# Altium project D8B-三锂电65W充电节-带屏幕.PrjPcb
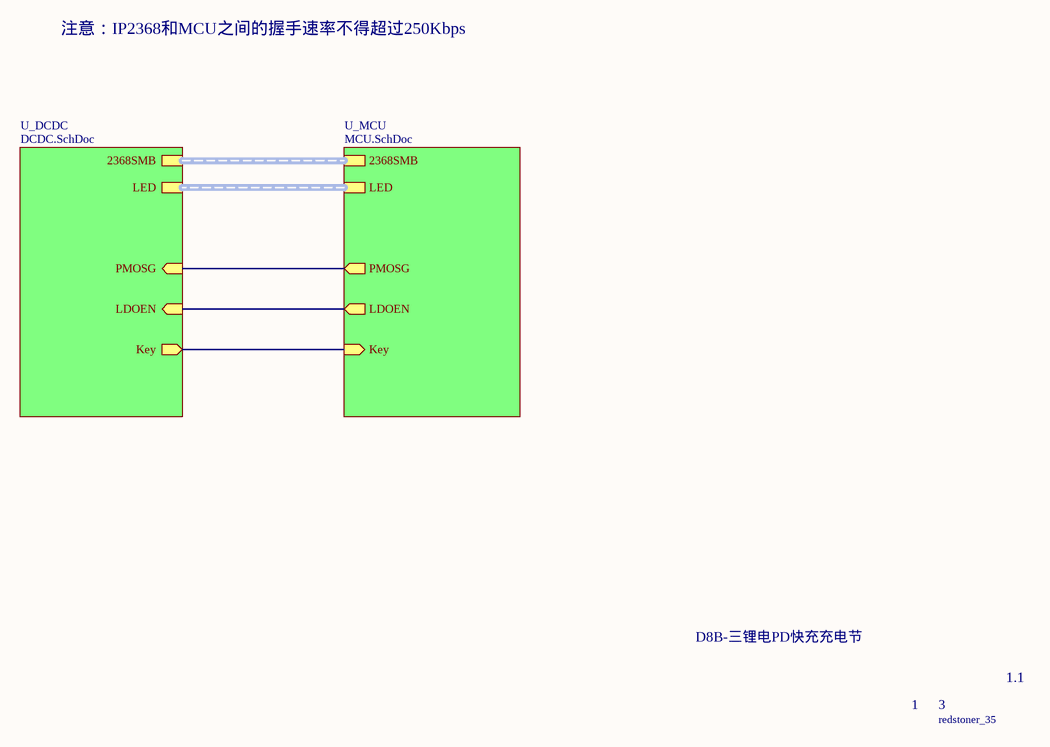
[diagram p0: Top.SchDoc]
3 sheets, 81 parts. Net scope: hierarchical (ports join the sheet entries above them; power ports are global).
Board file: PCB1.PcbDoc
Sheets:
  Top.SchDoc
    U_DCDC = DCDC.SchDoc
    U_MCU = MCU.SchDoc

## Sheet Top.SchDoc
size A4

### Sub-sheets
U_DCDC = DCDC.SchDoc: 2368SMB (harness 2368_SMB), PMOSG (in), LDOEN (in), LED (harness LED), Key (out)
U_MCU = MCU.SchDoc: PMOSG (out), 2368SMB (harness 2368_SMB), LDOEN (out), LED (harness LED), Key (in)

### Nets
Key: sheet U_DCDC/Key, sheet U_MCU/Key
MEN: sheet U_DCDC/LDOEN, sheet U_MCU/LDOEN
PMOSG: sheet U_DCDC/PMOSG, sheet U_MCU/PMOSG

### Buses and harness runs
harness sheet U_DCDC/2368SMB = sheet U_MCU/2368SMB
harness sheet U_DCDC/LED = sheet U_MCU/LED

### Notes on the sheet
- 注意：IP2368和MCU之间的握手速率不得超过250Kbps
- D8B-三锂电PD快充充电节
- 1
- 3
- 1.1
- redstoner_35

## Sheet DCDC.SchDoc
size A4
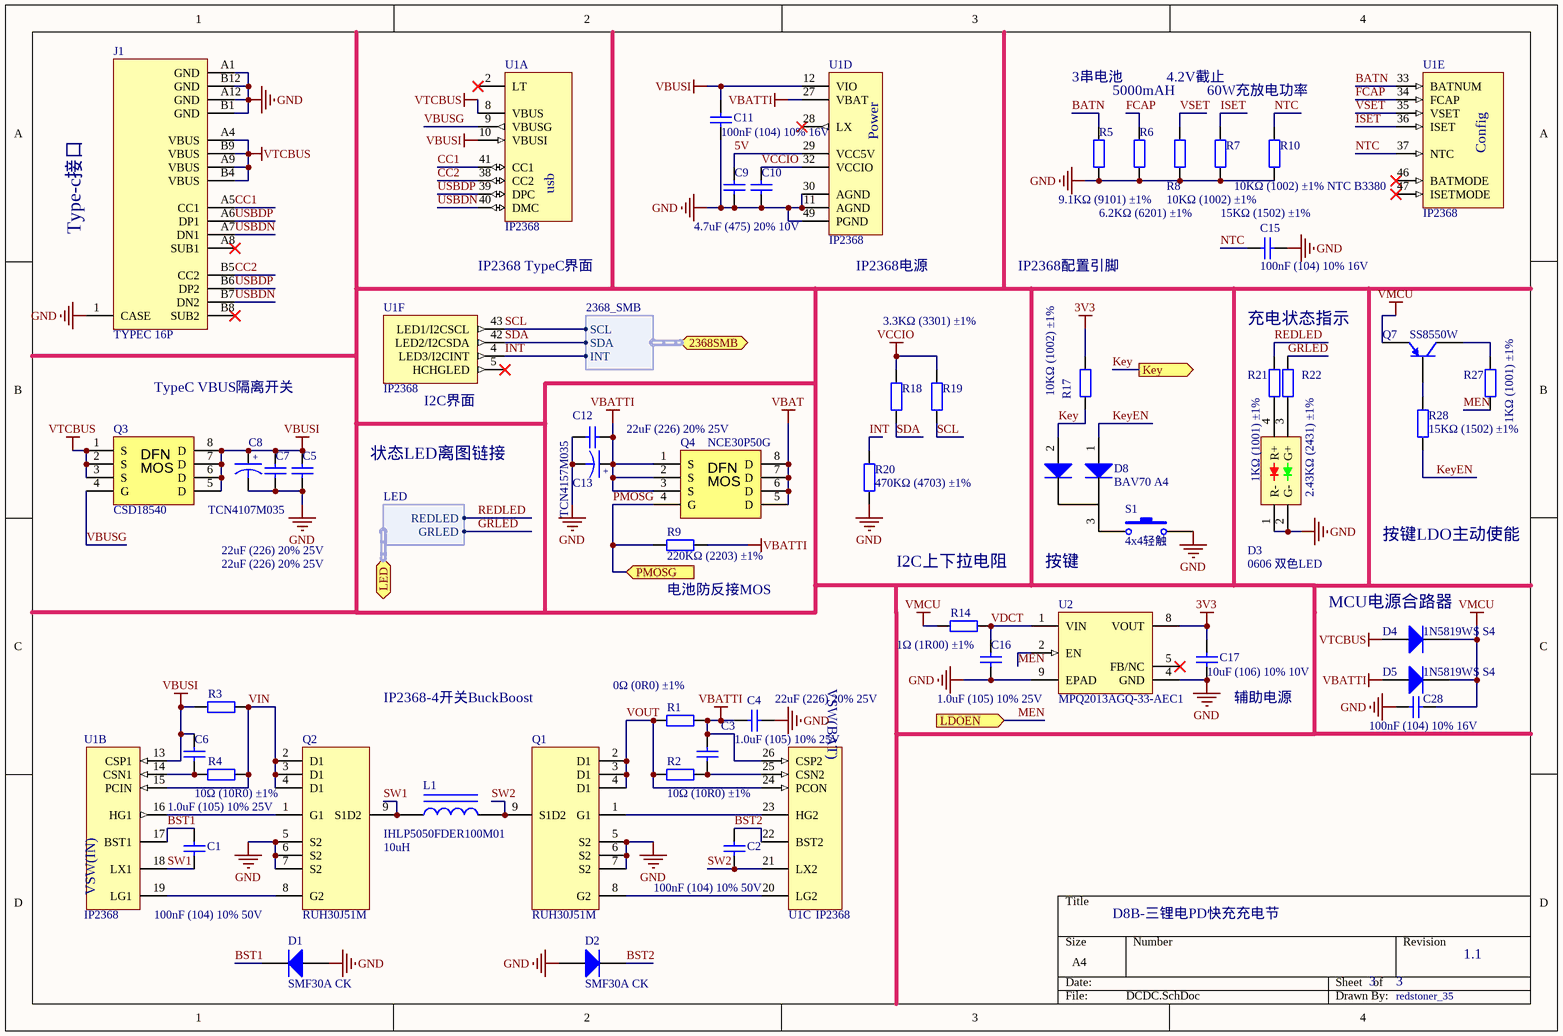
[diagram p1: DCDC.SchDoc]

### Parts
C1  100nF (104) 10% 50V  [0603_C]
C2  100nF (104) 10% 50V  [0603_C]
C3  1.0uF (105) 10% 25V  [0402_C]
C4  22uF (226) 20% 25V  [0805_C]
C5  22uF (226) 20% 25V  [0805_C]
C6  1.0uF (105) 10% 25V  [0402_C]
C7  22uF (226) 20% 25V  [0805_C]
C8  TCN4107M035  [TCN4]
C9  4.7uF (475) 20% 10V  [0402_C]
C10  4.7uF (475) 20% 10V  [0402_C]  (value not drawn)
C11  100nF (104) 10% 16V  [0402_C]
C12  22uF (226) 20% 25V  [0805_C]
C13  TCN4157M035  [TCN4]
C15  100nF (104) 10% 16V  [0402_C]
C16  1.0uF (105) 10% 25V  [0402_C]
C17  10uF (106) 10% 10V  [0603_C]
C28  100nF (104) 10% 16V  [0402_C]
D1  SMF30A CK  [SOD-123]
D2  SMF30A CK  [SOD-123]
D3  0606 双色LED  [LED-SMD_4P-L1.6-W1.5-TL-1]
D4  1N5819WS S4  [SOD-323]
D5  1N5819WS S4  [SOD-323]
D8  BAV70 A4  [SC70-3]
J1  TYPEC 16P  [USB-C-SMD_KH-TYPE-C-16P]
L1  IHLP5050FDER100M01  value 10uH  [IHLP5050FDER***M01]
Q1  RUH30J51M  [PDFN-8_L5.8-W4.9_RU30J30M]
Q2  RUH30J51M  [PDFN-8_L5.8-W4.9_RU30J30M]
Q3  CSD18540  [SON/DFN5x6(MOS)]
Q4  NCE30P50G  [SON/DFN5x6(MOS)]
Q7  SS8550W  [SC70-3]
R1  0Ω (0R0) ±1%  [1206_R]
R2  10Ω (10R0) ±1%  [0402_R]
R3  0Ω (0R0) ±1%  [1206_R]  (value not drawn)
R4  10Ω (10R0) ±1%  [0402_R]
R5  9.1KΩ (9101) ±1%  [0402_R]
R6  6.2KΩ (6201) ±1%  [0402_R]
R7  15KΩ (1502) ±1%  [0402_R]
R8  10KΩ (1002) ±1%  [0402_R]
R9  220KΩ (2203) ±1%  [0402_R]
R10  10KΩ (1002) ±1% NTC B3380  [0402_R]
R14  1Ω (1R00) ±1%  [0402_R]
R17  10KΩ (1002) ±1%  [0402_R]
R18  3.3KΩ (3301) ±1%  [0402_R]  (value not drawn)
R19  3.3KΩ (3301) ±1%  [0402_R]
R20  470KΩ (4703) ±1%  [0402_R]
R21  1KΩ (1001) ±1%  [0402_R]
R22  2.43KΩ (2431) ±1%  [0402_R]
R27  1KΩ (1001) ±1%  [0402_R]
R28  15KΩ (1502) ±1%  [0402_R]
S1  4x4轻触  [SW-SMD_4P-L5.2-W5.2-P3.70-LS6.4]
U1  IP2368  [QFN50P700X700X100_HS-49M]  (parts A,B,C,D,E,F of 6)
U2  MPQ2013AGQ-33-AEC1  [MPQ2013A-QFN8]

### Ports
2368SMB (harness 2368_SMB), Key (out), LDOEN (in), LED (harness LED), PMOSG (in)

### Harnesses
2368_SMB: SCL, SDA, INT
LED: REDLED, GRLED

### Nets
3V3: C17.2 R17.2 U2.8(VOUT)
GND: C4.2 C5.1 C7.1 C8.2 C9.1 C10.1 C11.1 C12.2 C13.2 C15.2 C16.1 C17.1 C28.1 D1.1(A) D2.1(A) D3.1(R-) D3.2(G-) J1.1(CASE) J1.A1(GND) J1.A12(GND) J1.B1(GND) J1.B12(GND) Q1.5(S2) Q1.6(S2) Q1.7(S2) Q2.5(S2) Q2.6(S2) Q2.7(S2) R5.1 R6.1 R7.1 R8.1 R10.1 R20.1 S1.2 U1.11(AGND) U1.30(AGND) U1.49(PGND) U2.4(GND) U2.9(EPAD)
VBAT: Q4.5(D) Q4.6(D) Q4.7(D) Q4.8(D)
VBATTI: C3.2 C4.1 C12.1 C13.1 D5.1(A) Q4.1(S) Q4.2(S) Q4.3(S) R1.2 R9.2 U1.26(CSP2) U1.27(VBAT)
VBUSI: C5.2 C6.2 C7.2 C8.1 C11.2 Q3.5(D) Q3.6(D) Q3.7(D) Q3.8(D) R3.1 U1.10(VBUSI) U1.12(VIO) U1.13(CSP1)
VCCIO: C10.2 R18.2 R19.2 U1.32(VCCIO)
VMCU: C28.2 D4.2(K) D5.2(K) Q7.2(E) R14.1
VTCBUS: D4.1(A) J1.A4(VBUS) J1.A9(VBUS) J1.B4(VBUS) J1.B9(VBUS) Q3.1(S) Q3.2(S) Q3.3(S) U1.8(VBUS)
5V: C9.2 U1.29(VCC5V)
BATN: R5.2 U1.33(BATNUM)
BST1: C1.2 D1.2(K) U1.17(BST1)
BST2: C2.2 D2.2(K) U1.22(BST2)
CC1: J1.A5(CC1) U1.41(CC1)
CC2: J1.B5(CC2) U1.38(CC2)
FCAP: R6.2 U1.34(FCAP)
GRLED: R22.1 ; port LED.GRLED
INT: R20.2 U1.4(LED3/I2CINT) ; port 2368SMB.INT
ISET: R7.2 U1.36(ISET)
Key: D8.2(A) R17.1 ; port Key
KeyEN: D8.1(A) R28.1
MEN: R27.1 U2.2(EN) ; port LDOEN
NTC: C15.1 R10.2 U1.37(NTC)
PMOSG: Q4.4(G) R9.1 ; port PMOSG
REDLED: R21.2 ; port LED.REDLED
SCL: R19.1 U1.43(LED1/I2CSCL) ; port 2368SMB.SCL
SDA: R18.1 U1.42(LED2/I2CSDA) ; port 2368SMB.SDA
SW1: C1.1 L1.1 Q2.9(S1D2) U1.18(LX1)
SW2: C2.1 L1.2 Q1.9(S1D2) U1.21(LX2)
USBDN: J1.A7(DN1) J1.B7(DN2) U1.40(DMC)
USBDP: J1.A6(DP1) J1.B6(DP2) U1.39(DPC)
VBUSG: Q3.4(G) U1.9(VBUSG)
VDCT: C16.2 R14.2 U2.1(VIN)
VIN: Q2.2(D1) Q2.3(D1) Q2.4(D1) R3.2 R4.2 U1.15(PCIN)
VOUT: Q1.2(D1) Q1.3(D1) Q1.4(D1) R1.1 R2.1 U1.24(PCON)
VSET: R8.2 U1.35(VSET)
NetC3_1: C3.1 R2.2 U1.25(CSN2)
NetC6_1: C6.1 R4.1 U1.14(CSN1)
NetD3_3: D3.3(G+) R22.2
NetD3_4: D3.4(R+) R21.1
NetD8_3: D8.3(K) S1.1
NetQ1_1: Q1.1(G1) U1.23(HG2)
NetQ1_8: Q1.8(G2) U1.20(LG2)
NetQ2_1: Q2.1(G1) U1.16(HG1)
NetQ2_8: Q2.8(G2) U1.19(LG1)
NetQ7_1: Q7.1(B) R28.2
NetQ7_3: Q7.3(C) R27.2

Not connected (* = marked no-connect by the designer): J1 A8(SUB1)* B8(SUB2)*; U1 2(LT)* 5(HCHGLED)* 28(LX)* 46(BATMODE)* 47(ISETMODE)*; U2 5(FB/NC)*

### Notes on the sheet
- 3串电池
- 5000mAH
- 4.2V截止
- 60W充放电功率
- (near J1) Type-c接口
- (near U1) IP2368 TypeC界面
- (near U1) IP2368电源
- IP2368配置引脚
- 充电状态指示
- TypeC VBUS隔离开关
- (near U1) I2C界面
- 状态LED离图链接
- I2C上下拉电阻
- 按键
- 按键LDO主动使能
- (near R9) 电池防反接MOS
- (near D4) MCU电源合路器
- IP2368-4开关BuckBoost
- (near C17) 辅助电源
- D8B-三锂电PD快充充电节
- 3
- 1.1
- redstoner_35
- (in symbol CAP2) +
- (in symbol IP2368, part A) usb
- (in symbol IP2368, part B) VSW(IN)
- (in symbol IP2368, part C) VSW(BAT)
- (in symbol IP2368, part D) Power
- (in symbol IP2368, part E) Config
- (in symbol SON/DFN5x6 MOS) DFN; MOS

### Library data of the parts
C1 C2 = 0603 100nF (104) 10% 50V: 贴片电容; ComponentLink1Description: 供应商链接; ComponentLink1URL: http://www.szlcsc.com/product/details_15331.html; Package: 0603; Supplier: LC; SuppliersPartNumber: C14663
C3 C6 C16 = 0402 1.0uF (105) 10% 25V: 贴片电容; ComponentLink1Description: 供应商链接; ComponentLink1URL: http://www.szlcsc.com/product/details_53938.html; Package: 0402; Supplier: LC; SuppliersPartNumber: C52923
C4 C5 C7 C12 = 0805 22uF (226) 20% 25V: 贴片电容; ComponentLink1Description: 供应商链接; ComponentLink1URL: http://www.szlcsc.com/product/details_46786.html; Package: 0805; Supplier: LC; SuppliersPartNumber: C45783
C8 C13 = CAP2: Capacitor
C9 C10 = 0402 4.7uF (475) 20% 10V: 贴片电容; ComponentLink1Description: 供应商链接; ComponentLink1URL: http://www.szlcsc.com/product/details_24469.html; Package: 0402; Supplier: LC; SuppliersPartNumber: C23733
C11 C15 C28 = 0402 100nF (104) 10% 16V: 贴片电容; ComponentLink1Description: 供应商链接; ComponentLink1URL: http://www.szlcsc.com/product/details_1877.html; Package: 0402; Supplier: LC; SuppliersPartNumber: C1525
C17 = 0603 10uF (106) 10% 10V: 贴片电容; ComponentLink1Description: 供应商链接; ComponentLink1URL: http://www.szlcsc.com/product/details_20411.html; Package: 0603; Supplier: LC; SuppliersPartNumber: C19702
D1 D2 = SOD-123 B5819W  SL: TVS二极管; ComponentLink1Description: 供应商链接; ComponentLink1URL: http://www.szlcsc.com/product/details_9093.html; Package: SOD-123; Supplier: LC; SuppliersPartNumber: C??????
D3 = 0606DualColor LED: 0606 双色LED 红色/翠绿
D4 D5 = SOD-323 1N4148WS T4: 二极管; ComponentLink1Description: 供应商链接; ComponentLink1URL: http://www.szlcsc.com/product/details_2485.html; Package: SOD-323; Supplier: LC; SuppliersPartNumber: C??????
D8 = SOT-23 BAV70 A4: 开关二极管; ComponentLink1Description: 供应商链接; ComponentLink1URL: http://www.szlcsc.com/product/details_70091.html; Package: SOT-23; Supplier: LC; SuppliersPartNumber: C68978
J1 = KH-TYPEC-16P: 16Pin TypeC立贴座子
L1 = Inductor Iron: Vishay Inductor 10uH 16.4mR 15.5A; Published: 24-Mar-1999; LatestRevisionDate: 17-Jul-2002; LatestRevisionNote: Re-released for DXP Platform.; PackageReference: AXIAL-0.9; Publisher: Altium Limited; PackageDescription: Axial Device, Thru-Hole; 2 Leads; 0.9 in Pin Spacing
Q1 Q2 = RU30J30M: Dual N MOSFET 30V/51A
Q3 Q4 = SON/DFN5x6 MOS: Gerenal DFN/SON Package MOSFET
Q7 = SOT-23 SS8550 Y2: 三极管; ComponentLink1Description: 供应商链接; ComponentLink1URL: http://www.szlcsc.com/product/details_9037.html; Package: SOT-23; Supplier: LC; SuppliersPartNumber: C8542
R1 R3 = 1206 0Ω (0R0) 1%: 贴片电阻; ComponentLink1Description: 供应商链接; ComponentLink1URL: http://www.szlcsc.com/product/details_18576.html; Package: 1206; Supplier: LC; SuppliersPartNumber: C17888
R2 R4 = 0402 10Ω (10R0) 1%: 贴片电阻; ComponentLink1Description: 供应商链接; ComponentLink1URL: http://www.szlcsc.com/product/details_25820.html; Package: 0402; Supplier: LC; SuppliersPartNumber: C25077
R5 R6 = 0402 0Ω (0R0) 1%: 贴片电阻; ComponentLink1Description: 供应商链接; ComponentLink1URL: http://www.szlcsc.com/product/details_17853.html; Package: 0402; Supplier: LC; SuppliersPartNumber: C17168
R7 R28 = 0402 15KΩ (1502) 1%: 贴片电阻; ComponentLink1Description: 供应商链接; ComponentLink1URL: http://www.szlcsc.com/product/details_26499.html; Package: 0402; Supplier: LC; SuppliersPartNumber: C25756
R8 R17 = 0402 10KΩ (1002) 1%: 贴片电阻; ComponentLink1Description: 供应商链接; ComponentLink1URL: http://www.szlcsc.com/product/details_26487.html; Package: 0402; Supplier: LC; SuppliersPartNumber: C25744
R9 = 0402 220KΩ (2203) 1%: 贴片电阻; ComponentLink1Description: 供应商链接; ComponentLink1URL: http://www.szlcsc.com/product/details_26510.html; Package: 0402; Supplier: LC; SuppliersPartNumber: C25767
R10 = 0402 10KΩ (1002) 1%: 贴片NTC热敏电阻; ComponentLink1Description: 供应商链接; ComponentLink1URL: http://www.szlcsc.com/product/details_26487.html; Package: 0402; Supplier: LC; SuppliersPartNumber: C???????????
R14 = 0402 1Ω (1R00) 1%: 贴片电阻; ComponentLink1Description: 供应商链接; ComponentLink1URL: http://www.szlcsc.com/product/details_25829.html; Package: 0402; Supplier: LC; SuppliersPartNumber: C25086
R18 R19 = 0402 3.3KΩ (3301) 1%: 贴片电阻; ComponentLink1Description: 供应商链接; ComponentLink1URL: http://www.szlcsc.com/product/details_26633.html; Package: 0402; Supplier: LC; SuppliersPartNumber: C25890
R20 = 0402 470KΩ (4703) 1%: 贴片电阻; ComponentLink1Description: 供应商链接; ComponentLink1URL: http://www.szlcsc.com/product/details_26533.html; Package: 0402; Supplier: LC; SuppliersPartNumber: C25790
R21 R27 = 0402 1KΩ (1001) 1%: 贴片电阻; ComponentLink1Description: 供应商链接; ComponentLink1URL: http://www.szlcsc.com/product/details_12256.html; Package: 0402; Supplier: LC; SuppliersPartNumber: C11702
R22 = 0402 2KΩ (2001) 1%: 贴片电阻; ComponentLink1Description: 供应商链接; ComponentLink1URL: http://www.szlcsc.com/product/details_4516.html; Package: 0402; Supplier: LC; SuppliersPartNumber: C????????
S1 = SW-PB: Switch; pin to pad: 2>3; Published: 24-Mar-1999; LatestRevisionDate: 17-Jul-2002; LatestRevisionNote: Re-released for DXP Platform.; PackageReference: SPST-2; Publisher: Altium Limited; PackageDescription: Switch; 2 Leads
U1 = IP2368: IP2368 2-5S 双向电池充放电管理，100W PD
U2 = MPQ2013AGQ-xx-AEC1: MPS 40V LDO with Enable pin QFN3x3 package

## Sheet MCU.SchDoc
size A4
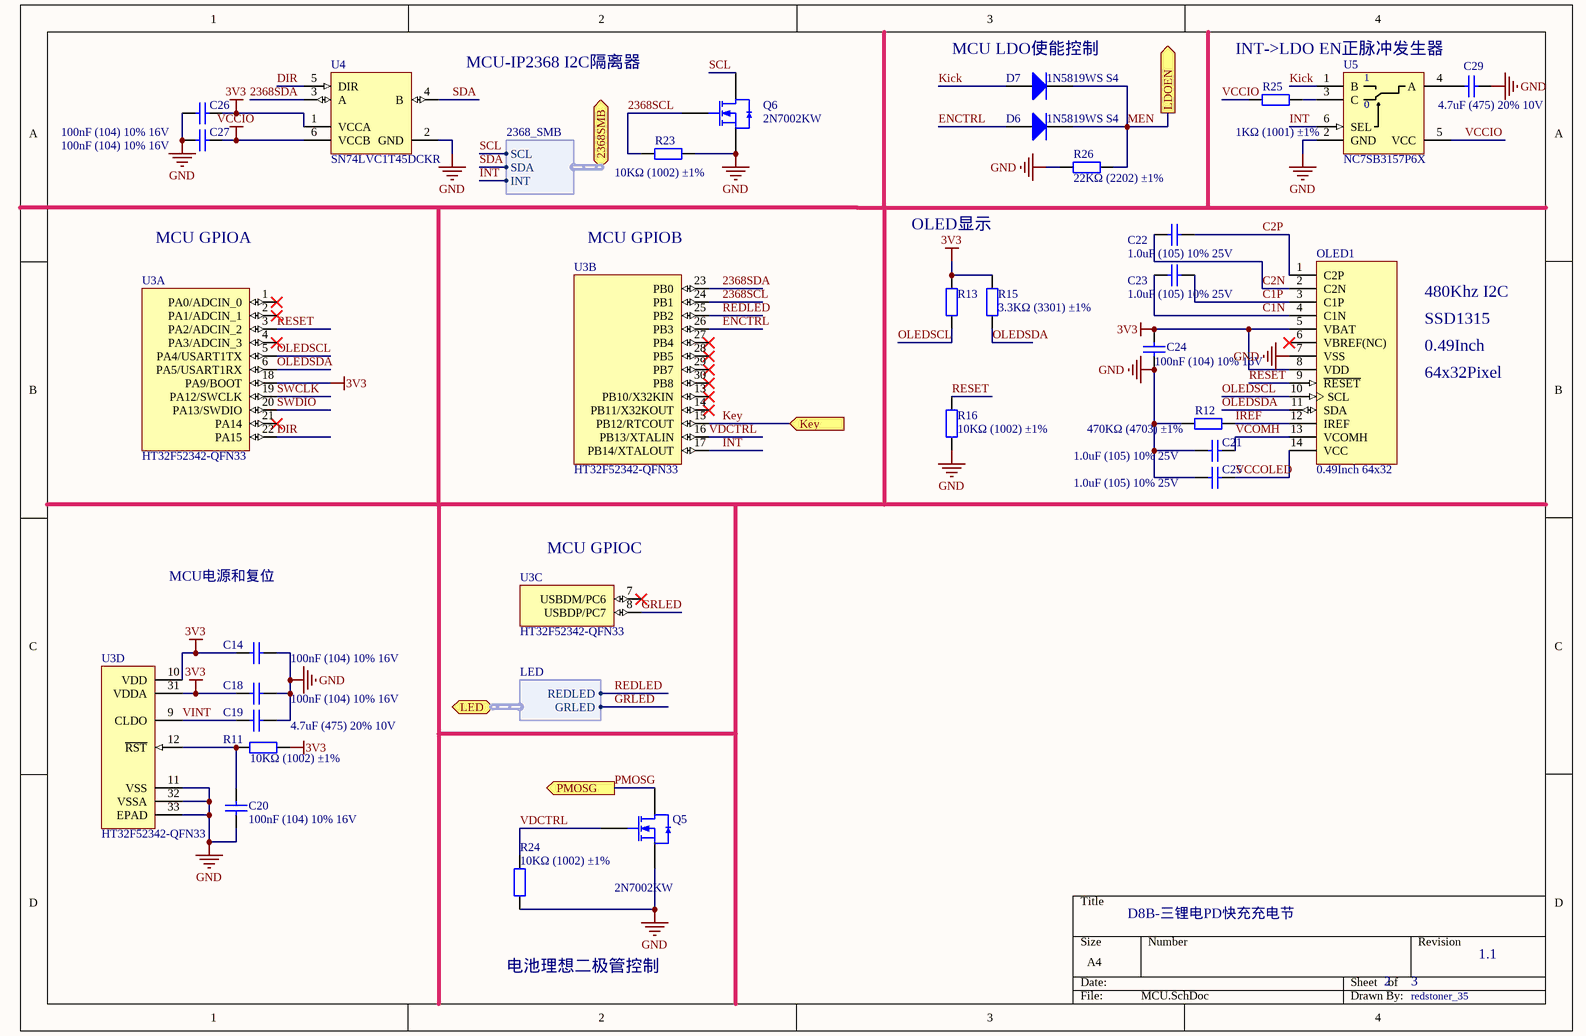
[diagram p2: MCU.SchDoc]

### Parts
C14  100nF (104) 10% 16V  [0402_C]
C18  100nF (104) 10% 16V  [0402_C]
C19  4.7uF (475) 20% 10V  [0402_C]
C20  100nF (104) 10% 16V  [0402_C]
C21  1.0uF (105) 10% 25V  [0402_C]
C22  1.0uF (105) 10% 25V  [0402_C]
C23  1.0uF (105) 10% 25V  [0402_C]
C24  100nF (104) 10% 16V  [0402_C]
C25  1.0uF (105) 10% 25V  [0402_C]
C26  100nF (104) 10% 16V  [0402_C]
C27  100nF (104) 10% 16V  [0402_C]
C29  4.7uF (475) 20% 10V  [0402_C]
D6  1N5819WS S4  [SOD-323]
D7  1N5819WS S4  [SOD-323]
OLED1  0.49Inch 64x32  [OLED-0.49Inch]
Q5  2N7002KW  [SC70-3]
Q6  2N7002KW  [SC70-3]
R11  10KΩ (1002) ±1%  [0402_R]
R12  470KΩ (4703) ±1%  [0402_R]
R13  3.3KΩ (3301) ±1%  [0402_R]  (value not drawn)
R15  3.3KΩ (3301) ±1%  [0402_R]
R16  10KΩ (1002) ±1%  [0402_R]
R23  10KΩ (1002) ±1%  [0402_R]
R24  10KΩ (1002) ±1%  [0402_R]
R25  1KΩ (1001) ±1%  [0402_R]
R26  22KΩ (2202) ±1%  [0402_R]
U3  HT32F52342-QFN33  [QFN32-HT32]  (parts A,B,C,D of 4)
U4  SN74LVC1T45DCKR  [DCK0006A_N]
U5  NC7SB3157P6X  [SC70-6]

### Ports
2368SMB (harness 2368_SMB), Key (in), LDOEN (out), LED (harness LED), PMOSG (out)

### Harnesses
2368_SMB: SCL, SDA, INT
LED: REDLED, GRLED

### Nets
3V3: C14.1 C18.1 C24.2 C26.2 OLED1.5(VBAT) OLED1.8(VDD) R11.2 R13.2 R15.2 U3.10(VDD) U3.18(PA9/BOOT) U3.31(VDDA) U4.1(VCCA)
GND: C14.2 C18.2 C19.2 C20.1 C21.2 C24.1 C25.1 C26.1 C27.1 C29.2 OLED1.7(VSS) Q5.2(S) Q6.2(S) R12.2 R16.1 R23.2 R24.1 R26.1 U3.11(VSS) U3.32(VSSA) U3.33(EPAD) U4.2(GND) U5.2(GND)
VCCIO: C27.2 R25.1 U4.6(VCCB) U5.5(VCC)
2368SCL: Q6.1(G) R23.1 U3.24(PB1)
2368SDA: U3.23(PB0) U4.3(A)
C1N: C23.2 OLED1.4(C1N)
C1P: C23.1 OLED1.3(C1P)
C2N: C22.2 OLED1.2(C2N)
C2P: C22.1 OLED1.1(C2P)
DIR: U3.22(PA15) U4.5(DIR)
ENCTRL: D6.1(A) U3.26(PB3)
GRLED: U3.8(USBDP/PC7) ; port LED.GRLED
INT: U3.17(PB14/XTALOUT) U5.6(SEL) ; port 2368SMB.INT
IREF: OLED1.12(IREF) R12.1
Key: U3.15(PB12/RTCOUT) ; port Key
Kick: D7.1(A) U5.1(B)
MEN: D6.2(K) D7.2(K) R26.2 ; port LDOEN
OLEDSCL: OLED1.10(SCL) R13.1 U3.5(PA4/USART1TX)
OLEDSDA: OLED1.11(SDA) R15.1 U3.6(PA5/USART1RX)
PMOSG: Q5.3(D) ; port PMOSG
REDLED: U3.25(PB2) ; port LED.REDLED
RESET: OLED1.9(~{RESET}) R16.2 U3.3(PA2/ADCIN_2)
SCL: Q6.3(D) ; port 2368SMB.SCL
SDA: U4.4(B) ; port 2368SMB.SDA
SWCLK: U3.19(PA12/SWCLK)
SWDIO: U3.20(PA13/SWDIO)
VCCOLED: C25.2 OLED1.14(VCC)
VCOMH: C21.1 OLED1.13(VCOMH)
VDCTRL: Q5.1(G) R24.2 U3.16(PB13/XTALIN)
VINT: C19.1 U3.9(CLDO)
NetC20_2: C20.2 R11.1 U3.12(~{RST})
NetC29_1: C29.1 U5.4(A)
NetR25_2: R25.2 U5.3(C)

Not connected (* = marked no-connect by the designer): OLED1 6(VBREF(NC))*; U3 1(PA0/ADCIN_0)* 2(PA1/ADCIN_1)* 4(PA3/ADCIN_3)* 7(USBDM/PC6)* 13(PB10/X32KIN)* 14(PB11/X32KOUT)* 21(PA14)* 27(PB4)* 28(PB5)* 29(PB7)* 30(PB8)*

### Notes on the sheet
- MCU-IP2368 I2C隔离器
- (near D7) MCU LDO使能控制
- INT->LDO EN正脉冲发生器
- MCU GPIOA
- (near U3) MCU GPIOB
- OLED显示
- 480Khz I2C
- SSD1315
- 0.49Inch
- 64x32Pixel
- MCU电源和复位
- (near U3) MCU GPIOC
- D8B-三锂电PD快充充电节
- 电池理想二极管控制
- 2
- 3
- 1.1
- redstoner_35
- (in symbol NC7SB3157P6X) 0

### Library data of the parts
C14 C18 C20 C24 C26 C27 = 0402 100nF (104) 10% 16V: 贴片电容; ComponentLink1Description: 供应商链接; ComponentLink1URL: http://www.szlcsc.com/product/details_1877.html; Package: 0402; Supplier: LC; SuppliersPartNumber: C1525
C19 C29 = 0402 4.7uF (475) 20% 10V: 贴片电容; ComponentLink1Description: 供应商链接; ComponentLink1URL: http://www.szlcsc.com/product/details_24469.html; Package: 0402; Supplier: LC; SuppliersPartNumber: C23733
C21-C23 C25 = 0402 1.0uF (105) 10% 25V: 贴片电容; ComponentLink1Description: 供应商链接; ComponentLink1URL: http://www.szlcsc.com/product/details_53938.html; Package: 0402; Supplier: LC; SuppliersPartNumber: C52923
D6 D7 = SOD-323 1N4148WS T4: 二极管; ComponentLink1Description: 供应商链接; ComponentLink1URL: http://www.szlcsc.com/product/details_2485.html; Package: SOD-323; Supplier: LC; SuppliersPartNumber: C??????
OLED1 = 0.49Inch OLED: 0.49英寸OLED 64*32像素
Q5 Q6 = 2N7002 7002: MOS(场效应管); ComponentLink1Description: 供应商链接; ComponentLink1URL: http://www.szlcsc.com/product/details_9040.html; Package: SOT-323; Supplier: LC; SuppliersPartNumber: C???????
R11 R16 R23 R24 = 0402 10KΩ (1002) 1%: 贴片电阻; ComponentLink1Description: 供应商链接; ComponentLink1URL: http://www.szlcsc.com/product/details_26487.html; Package: 0402; Supplier: LC; SuppliersPartNumber: C25744
R12 = 0402 470KΩ (4703) 1%: 贴片电阻; ComponentLink1Description: 供应商链接; ComponentLink1URL: http://www.szlcsc.com/product/details_26533.html; Package: 0402; Supplier: LC; SuppliersPartNumber: C25790
R13 R15 = 0402 3.3KΩ (3301) 1%: 贴片电阻; ComponentLink1Description: 供应商链接; ComponentLink1URL: http://www.szlcsc.com/product/details_26633.html; Package: 0402; Supplier: LC; SuppliersPartNumber: C25890
R25 = 0402 1KΩ (1001) 1%: 贴片电阻; ComponentLink1Description: 供应商链接; ComponentLink1URL: http://www.szlcsc.com/product/details_12256.html; Package: 0402; Supplier: LC; SuppliersPartNumber: C11702
R26 = 0402 22KΩ (2202) 1%: 贴片电阻; ComponentLink1Description: 供应商链接; ComponentLink1URL: http://www.szlcsc.com/product/details_26511.html; Package: 0402; Supplier: LC; SuppliersPartNumber: C25768
U3 = HT32F52352-QFN: Holtek MCU Cortex M0+ 48MHz 64K ROM 16K RAM
U4 = SN74LVC1T45DCKR: Single-Bit Dual-Supply Bus Transceiver with Configurable Voltage Translation and 3-State Outputs, DCK0006A, LARGE T&R; Manufacturer: Texas Instruments; VCC(Min)(V): 1.65; VCC(Max)(V): 5.5; Output Type: CMOS; ICC @ Nom Voltage(Max)(mA): 0.004; Input Type: CMOS/TTL; Bits(#): 1; F @ Nom Voltage(Max)(Mhz): 150; Rating: Catalog; Technology Family: LVC; Voltage(Nom)(V): 1.8,2.5,3.3,5; Schmitt Trigger: No; Output Drive (IOL/IOH)(Max)(mA): 32/-32; tpd @ Nom Voltage(Max)(ns): 15.5,8,5.8,4.4; Logic: True; Sub-Family: Dual Supply Translator; 3-State Output: Yes; DatasheetVersion: SCES515K; PackageReference: DCK0006A; Supplier 1: Mouser; Supplier Part Number 1: 595-SN74LVC1T45DCKR; Supplier 2: Digi-Key; Supplier Part Number 2: 296-16844-2-ND; Supplier 3: Digi-Key; Supplier Part Number 3: 296-16844-1-ND; Supplier 4: Digi-Key; Supplier Part Number 4: 296-16844-6-ND; Generic Part Number: SN74LVC1T45; Operating Temperature Range(C): -40 to 85; PartNumber: SN74LVC1T45DCKR; ComponentLink1Description: Manufacturer URL; ComponentLink1URL: http://www.ti.com/; ComponentLink2Description: Datasheet; ComponentLink2URL: http://www.ti.com/lit/ds/symlink/sn74lvc1t45.pdf
U5 = NC7SB3157P6X: Low-Voltage Analog Switch SPDT,1.8-5V Power

## Nets that join several sheets
3V3: DCDC (C17.2 R17.2 U2.8), MCU (13 pins)
GND: DCDC (40 pins), MCU (23 pins)
VCCIO: DCDC (C10.2 R18.2 R19.2 U1.32), MCU (C27.2 R25.1 U4.6 U5.5)
GRLED: DCDC (R22.1), MCU (U3.8)
INT: DCDC (R20.2 U1.4), MCU (U3.17 U5.6)
Key: DCDC (D8.2 R17.1), MCU (U3.15)
MEN: DCDC (R27.1 U2.2), MCU (D6.2 D7.2 R26.2)
PMOSG: DCDC (Q4.4 R9.1), MCU (Q5.3)
REDLED: DCDC (R21.2), MCU (U3.25)
SCL: DCDC (R19.1 U1.43), MCU (Q6.3)
SDA: DCDC (R18.1 U1.42), MCU (U4.4)